# EAGLE design Model01 (EAGLE 7.4.0)
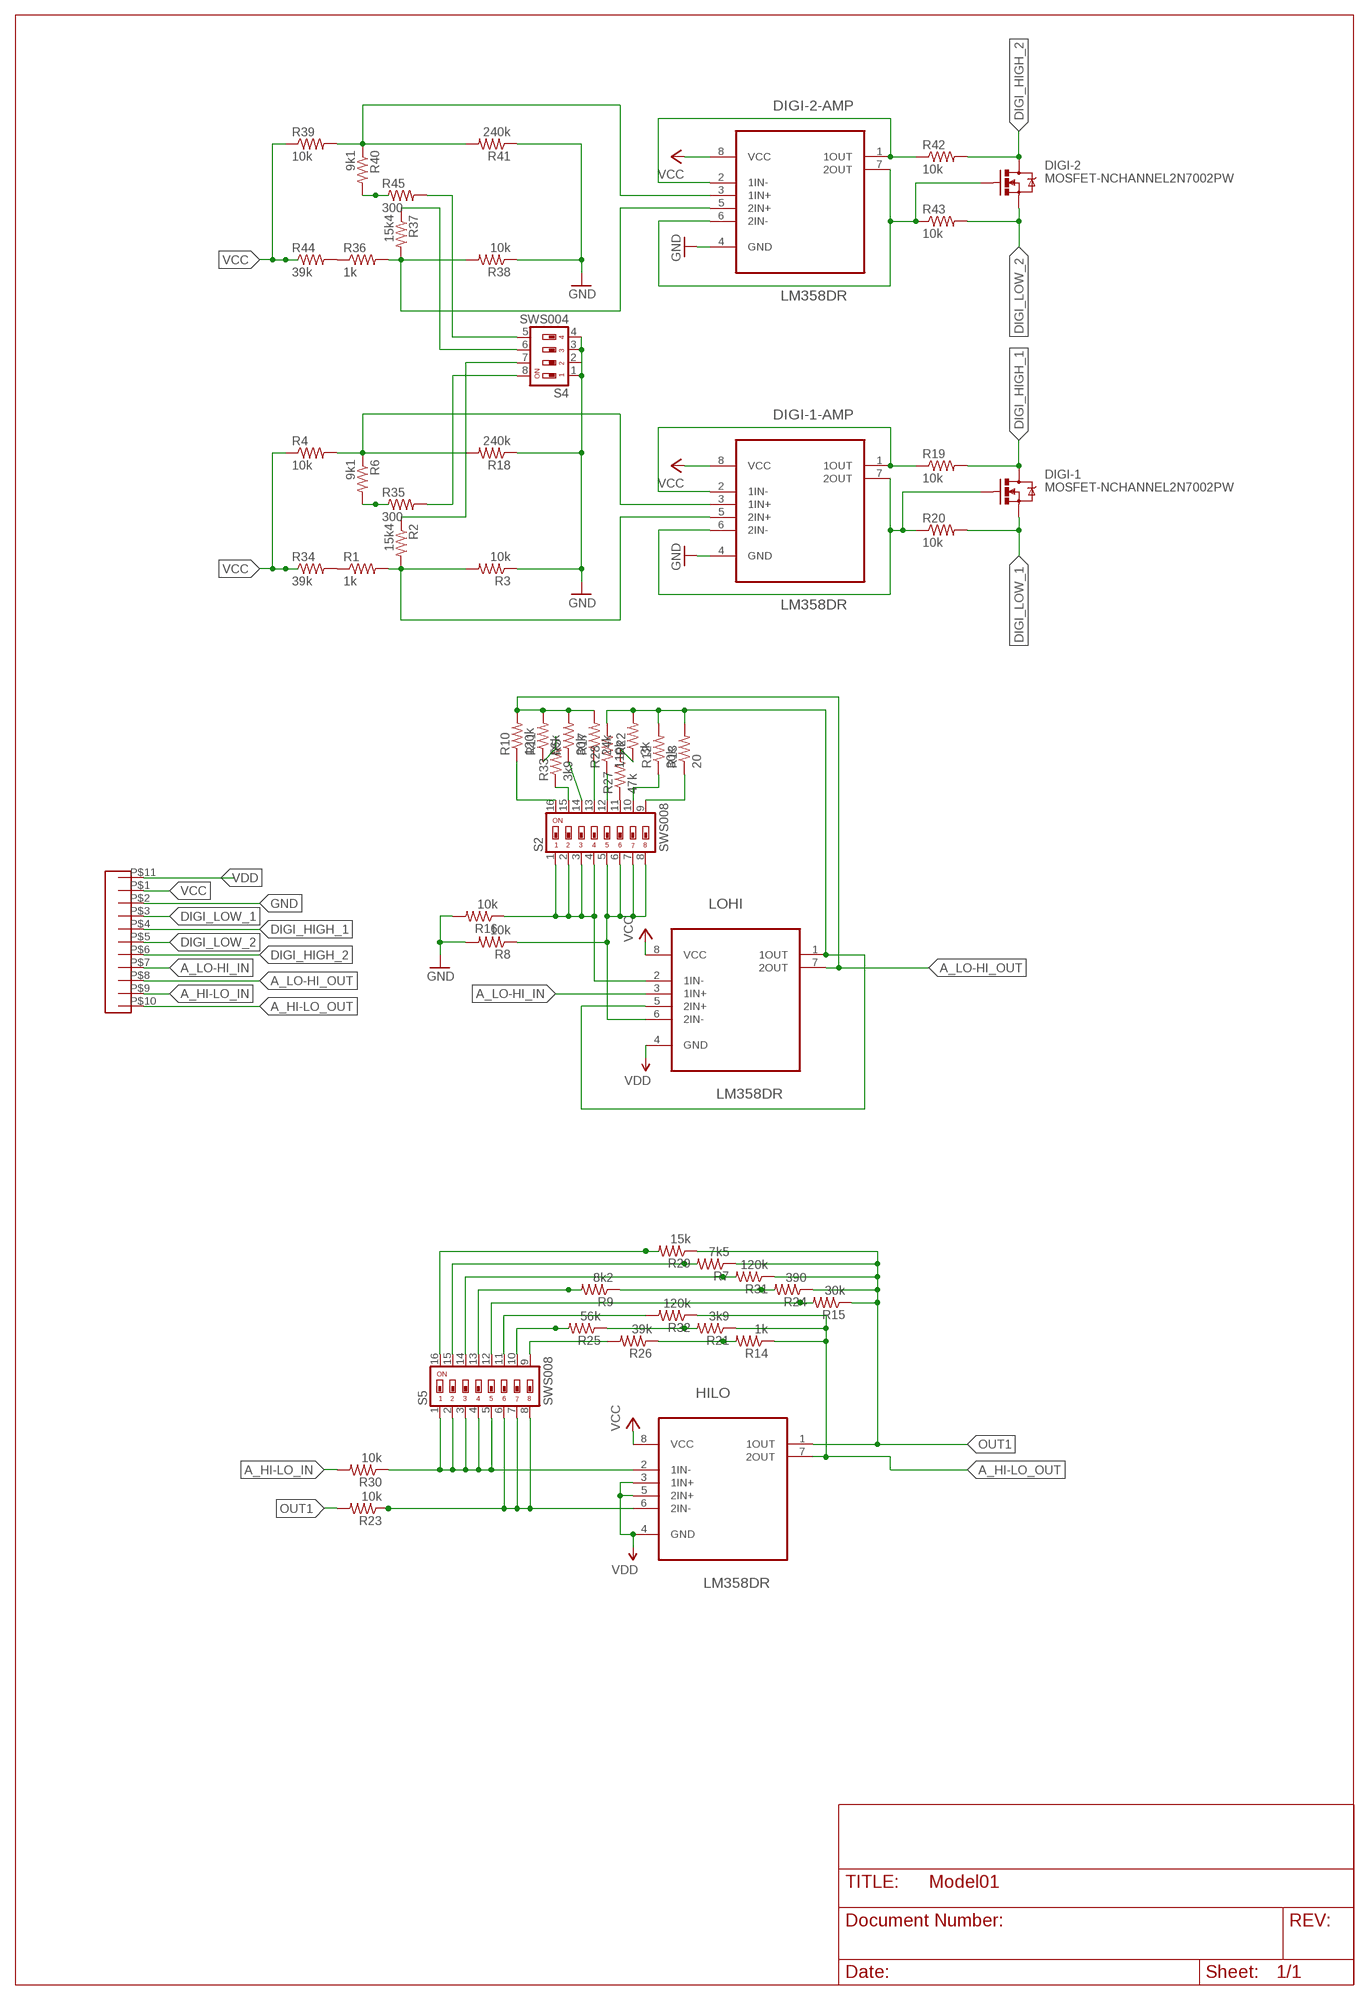
[diagram p0: schematic, sheet 1]

## Parts
DIGI-1  MOSFET-NCHANNEL2N7002PW  [SOT323]
DIGI-1-AMP  LM358DR  [SOIC127P600X175-8N]
DIGI-2  MOSFET-NCHANNEL2N7002PW  [SOT323]
DIGI-2-AMP  LM358DR  [SOIC127P600X175-8N]
HILO  LM358DR  [SOIC127P600X175-8N]
LOHI  LM358DR  [SOIC127P600X175-8N]
R1  1k  R-US_R0805  [R0805]
R2  15k4  R-US_R0805  [R0805]
R3  10k  R-US_R0805  [R0805]
R4  10k  R-US_R0805  [R0805]
R5  30k  R-US_R0805  [R0805]
R6  9k1  R-US_R0805  [R0805]
R7  7k5  R-US_R0805  [R0805]
R8  10k  R-US_R0805  [R0805]
R9  8k2  R-US_R0805  [R0805]
R10  120k  R-US_R0805  [R0805]
R11  56k  R-US_R0805  [R0805]
R12  30k  R-US_R0805  [R0805]
R13  20  R-US_R0805  [R0805]
R14  1k  R-US_R0805  [R0805]
R15  30k  R-US_R0805  [R0805]
R16  10k  R-US_R0805  [R0805]
R17  24k  R-US_R0805  [R0805]
R18  240k  R-US_R0805  [R0805]
R19  10k  R-US_R0805  [R0805]
R20  10k  R-US_R0805  [R0805]
R21  3k9  R-US_R0805  [R0805]
R22  3k  R-US_R0805  [R0805]
R23  10k  R-US_R0805  [R0805]
R24  390  R-US_R0805  [R0805]
R25  56k  R-US_R0805  [R0805]
R26  39k  R-US_R0805  [R0805]
R27  47k  R-US_R0805  [R0805]
R28  110k  R-US_R0805  [R0805]
R29  15k  R-US_R0805  [R0805]
R30  10k  R-US_R0805  [R0805]
R31  120k  R-US_R0805  [R0805]
R32  120k  R-US_R0805  [R0805]
R33  3k9  R-US_R0805  [R0805]
R34  39k  R-US_R0805  [R0805]
R35  300  R-US_R0805  [R0805]
R36  1k  R-US_R0805  [R0805]
R37  15k4  R-US_R0805  [R0805]
R38  10k  R-US_R0805  [R0805]
R39  10k  R-US_R0805  [R0805]
R40  9k1  R-US_R0805  [R0805]
R41  240k  R-US_R0805  [R0805]
R42  10k  R-US_R0805  [R0805]
R43  10k  R-US_R0805  [R0805]
R44  39k  R-US_R0805  [R0805]
R45  300  R-US_R0805  [R0805]
S2  SWS008  [SMS-008]
S4  SWS004  [SMS-004]
S5  SWS008  [SMS-008]
U$1  5.08PITCHTERMINAL  [10KPL508]

## Nets
A_HI-LO_IN: R30.2 U$1.P$9
A_HI-LO_OUT: HILO.7(2OUT) R14.1 R21.1 R32.1 U$1.P$10
A_LO-HI_IN: LOHI.3(1IN+) U$1.P$7
A_LO-HI_OUT: LOHI.7(2OUT) R5.2 R10.2 R11.2 R17.2 U$1.P$8
DI-1: DIGI-1-AMP.1(1OUT) DIGI-1-AMP.2(1IN-) R19.1
DIGI_HIGH_1: DIGI-1.3(D) R19.2 U$1.P$4
DIGI_HIGH_2: DIGI-2.3(D) R42.2 U$1.P$6
DIGI_LOW_1: DIGI-1.2(S) R20.2 U$1.P$3
DIGI_LOW_2: DIGI-2.2(S) R43.2 U$1.P$5
GND: DIGI-1-AMP.4(GND) DIGI-2-AMP.4(GND) R3.1 R8.2 R16.2 R18.1 R38.1 R41.1 S4.1 S4.2 S4.3 S4.4 U$1.P$2
N$2: DIGI-1-AMP.3(1IN+) R4.2 R6.1 R18.2
N$4: R2.1 S4.7
N$5: R6.2 R35.1
N$6: DIGI-1-AMP.5(2IN+) R1.2 R2.2 R3.2
N$8: DIGI-1-AMP.6(2IN-) DIGI-1-AMP.7(2OUT) DIGI-1.1(G) R20.1
N$9: DIGI-2-AMP.5(2IN+) R36.2 R37.2 R38.2
N$10: HILO.2(1IN-) R30.1 S5.1 S5.2 S5.3 S5.4 S5.5
N$11: DIGI-2-AMP.3(1IN+) R39.2 R40.1 R41.2
N$13: R10.1 S2.16
N$14: R33.1 S2.15
N$15: R1.1 R34.2
N$16: R5.1 S2.14
N$17: R17.1 S2.13
N$18: R28.1 S2.12
N$19: R27.1 S2.11
N$20: R12.1 S2.10
N$21: R13.1 S2.9
N$22: R29.2 S5.16
N$23: LOHI.1(1OUT) LOHI.5(2IN+) R12.2 R13.2 R22.2 R28.2
N$24: R7.2 S5.15
N$26: R31.2 S5.14
N$27: R9.2 S5.13
N$28: R15.2 S5.12
N$29: R32.2 S5.11
N$30: HILO.6(2IN-) R23.1 S5.6 S5.7 S5.8
N$31: R25.2 S5.10
N$32: R26.2 S5.9
N$34: R14.2 R26.1
N$36: R21.2 R25.1
N$37: R9.1 R24.2
N$38: R22.1 R27.2
N$41: R11.1 R33.2
N$42: R35.2 S4.8
N$46: LOHI.2(1IN-) R16.1 S2.1 S2.2 S2.3 S2.4
N$50: LOHI.6(2IN-) R8.1 S2.5 S2.6 S2.7 S2.8
N$63: DIGI-2-AMP.1(1OUT) DIGI-2-AMP.2(1IN-) R42.1
N$64: DIGI-2-AMP.6(2IN-) DIGI-2-AMP.7(2OUT) DIGI-2.1(G) R43.1
N$67: R37.1 S4.6
N$68: R36.1 R44.2
N$69: R40.2 R45.1
N$70: R45.2 S4.5
OUT1: HILO.1(1OUT) R7.1 R15.1 R23.2 R24.1 R29.1 R31.1
VCC: DIGI-1-AMP.8(VCC) DIGI-2-AMP.8(VCC) HILO.8(VCC) LOHI.8(VCC) R4.1 R34.1 R39.1 R44.1 U$1.P$1
VDD: HILO.3(1IN+) HILO.4(GND) HILO.5(2IN+) LOHI.4(GND) U$1.P$11

## Library data of the parts
DIGI-1 DIGI-2 = SparkFun-DiscreteSemi:MOSFET-NCHANNEL: Common NMOSFET Parts MFG P/N Store ID Prod ID FDD8780 TRANS-09984 SI7820DN TRANS-11055 FDS6630A IC-08089 2N7002PW TRANS-11151 FQP30N06L COM-10213 TRANS-10060 BSS123LT1G TRANS-08345 BSS138 TRANS-00830 BS170 2N7000; PROD_ID: TRANS-11151
DIGI-1-AMP DIGI-2-AMP HILO LOHI = Texas Instruments_By_element14_Batch_1:LM358DR: OPERATIONAL AMPLIFIERS; MPN: LM358DR; OC_FARNELL: 1831865; OC_NEWARK: 34K7599; PACKAGE: SOIC-8; SUPPLIER: Texas Instruments
R1-R45 = rcl:R-US_: RESISTOR, American symbol
S2 S5 = smd-special:SWS008: SMD Dip Switch 8 pol.
S4 = smd-special:SWS004: SMD Dip Switch 4 pol.
U$1 = ruuviliitin:5.08PITCHTERMINAL

## Board
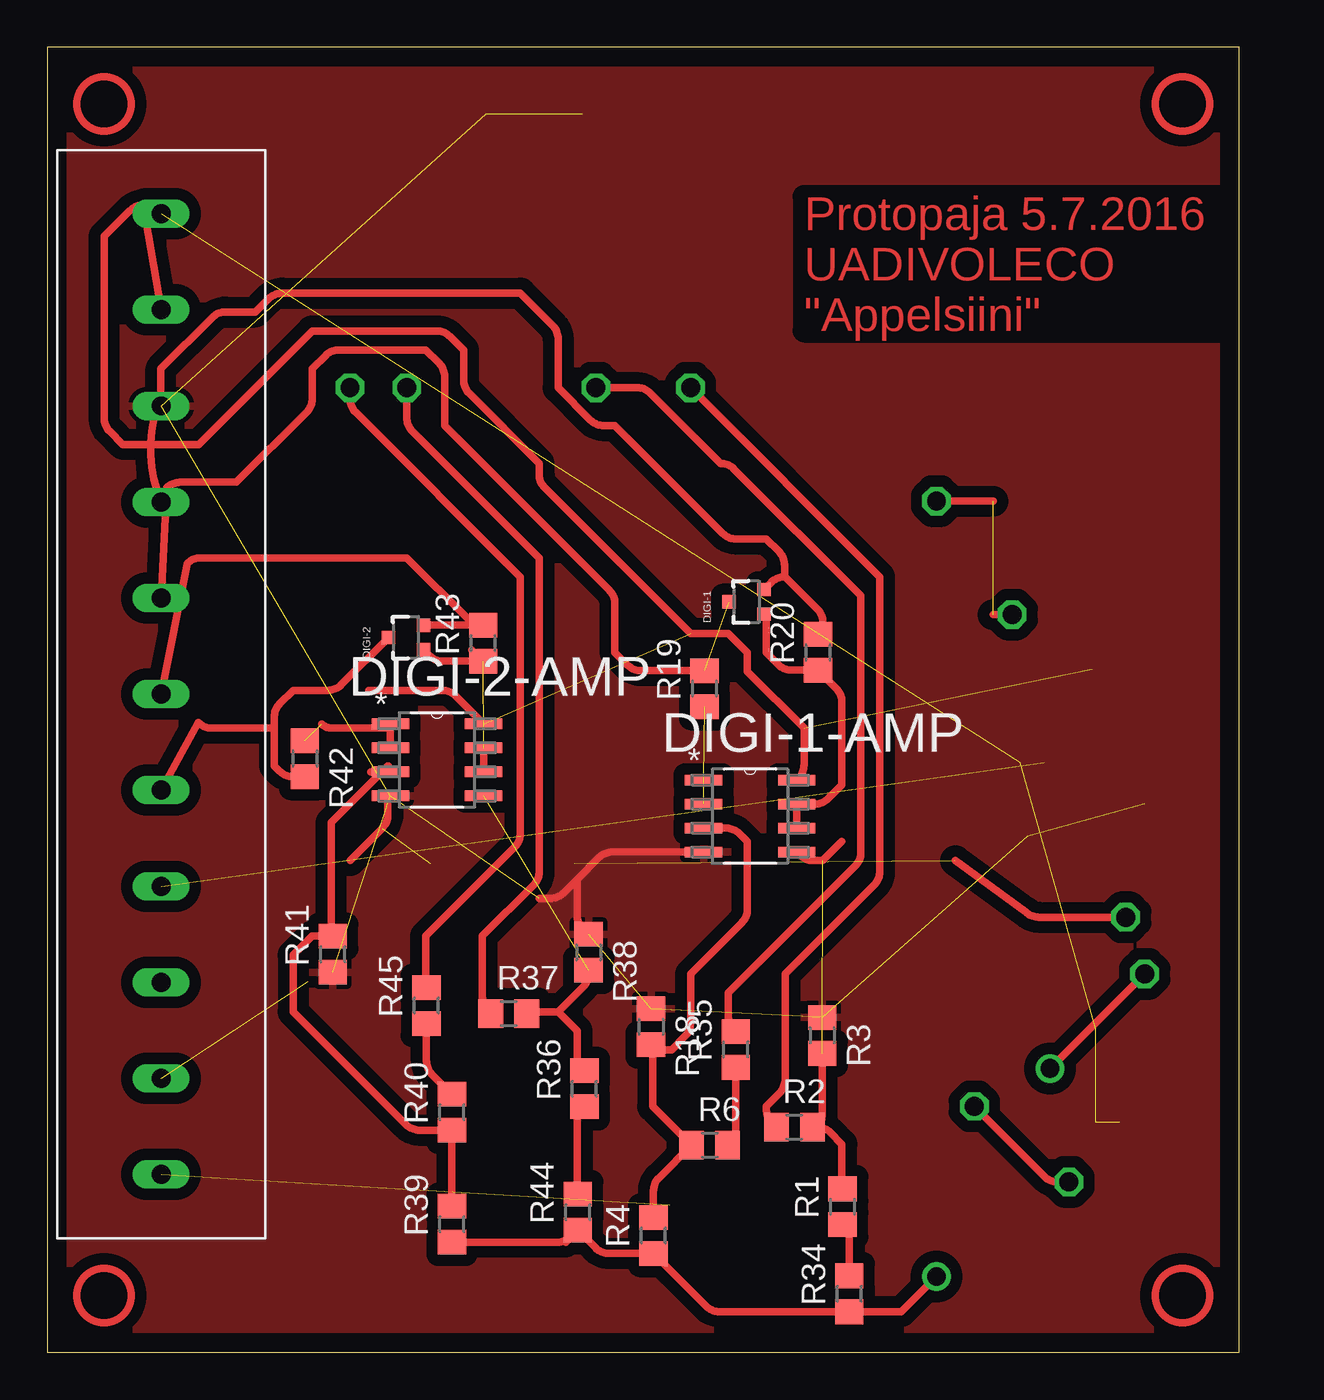
[diagram p1: board, top side]
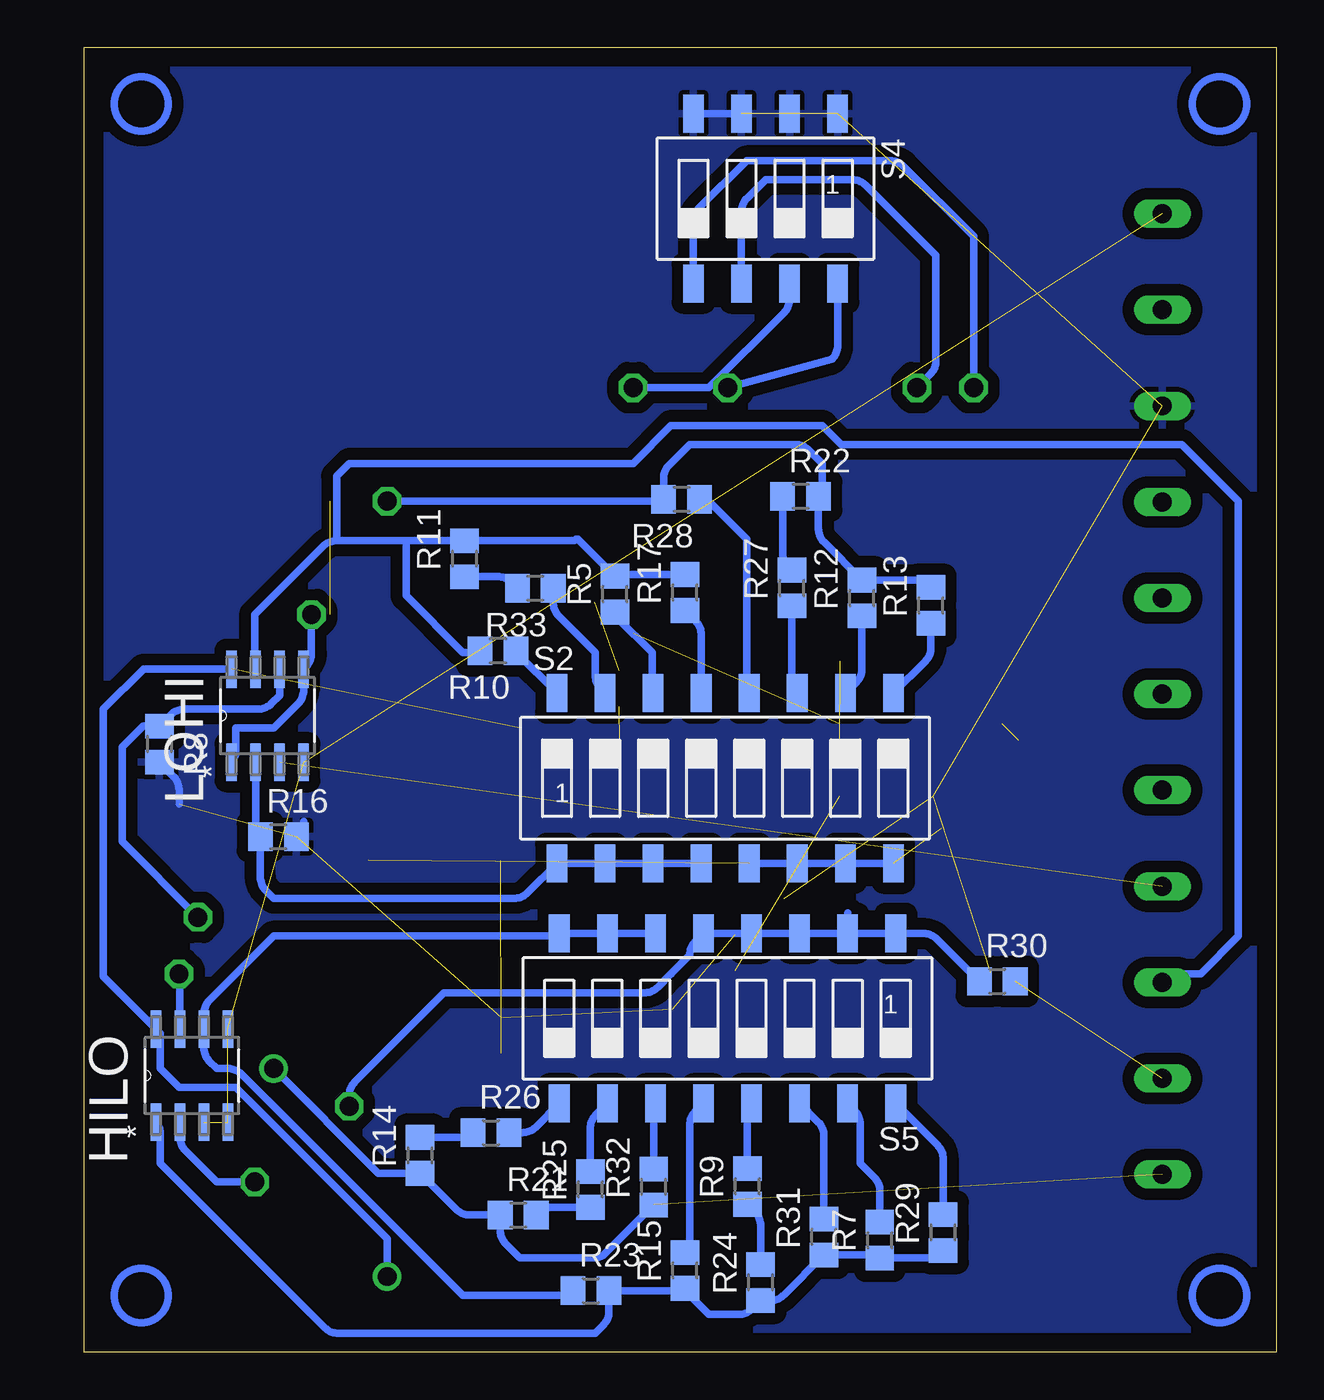
[diagram p2: board, bottom side, seen from below]

Size 63 x 69 mm. Coordinates in mm from the lower left corner, seen from the top.
Outline: 0,0 63,0 63,69 0,69 0,0
Copper layers (1*16): Top 0.035mm / dielectric 1.5mm / Bottom 0.035mm
Design rules "default": minimum track width 10mil, minimum drill 24mil, track to track 8mil, track to pad 8mil, pad to pad 8mil, via to via 8mil, smd to smd 8mil, copper to edge 40mil, drill to drill 8mil, minimum pad ring 10mil, minimum via ring 8mil, stop-mask expansion 4mil, vias tented up to drill 0mil, thermal gap 10mil

### Footprints (pad centres in the part's own frame; a part is rotated, then mirrored left to right if it is on the bottom)
SOT323 = smd 0.7 x 0.7: 1 -0.65,-0.925; 2 0.65,-0.925; 3 0,0.925
SOIC127P600X175-8N = smd 1.981 x 0.559: 1 -2.464,1.905; 2 -2.464,0.635; 3 -2.464,-0.635; 4 -2.464,-1.905; 5 2.464,-1.905; 6 2.464,-0.635; 7 2.464,0.635; 8 2.464,1.905
R0805 = smd 1.3 x 1.5: 1 -0.95,0; 2 0.95,0
SMS-008 = smd 1.092 x 2.007: 1 -8.89,-4.496; 2 -6.35,-4.496; 3 -3.81,-4.496; 4 -1.27,-4.496; 5 1.27,-4.496; 6 3.81,-4.496; 7 6.35,-4.496; 8 8.89,-4.496; 9 8.89,4.496; 10 6.35,4.496; 11 3.81,4.496; 12 1.27,4.496; 13 -1.27,4.496; 14 -3.81,4.496; 15 -6.35,4.496; 16 -8.89,4.496
SMS-004 = smd 1.092 x 2.007: 1 -3.81,-4.496; 2 -1.27,-4.496; 3 1.27,-4.496; 4 3.81,-4.496; 5 3.81,4.496; 6 1.27,4.496; 7 -1.27,4.496; 8 -3.81,4.496
10KPL508 = drill 1 long: P$1 -20.32,0; P$2 -15.24,0; P$3 -10.16,0; P$4 -5.08,0; P$5 0,0; P$6 5.08,0; P$7 10.16,0; P$8 15.24,0; P$9 20.32,0; P$10 25.4,0; P$11 -25.4,0

### Placement (x,y rotation side)
DIGI-1  36.96,39.68 90 top
DIGI-1-AMP  37.15,28.35 0 top
DIGI-2  18.96,37.79 90 top
DIGI-2-AMP  20.6,31.32 0 top
HILO  57.32,14.63 90 bottom
LOHI  53.32,33.66 90 bottom
R1  42.04,7.69 90 top
R2  39.49,11.91 0 top
R3  40.96,16.75 270 top
R4  32.04,6.17 90 top
R5  34.96,40.09 90 bottom
R6  35.01,10.96 0 top
R7  20.96,5.93 90 bottom
R8  59.04,32.15 270 bottom
R9  27.96,8.77 90 bottom
R10  41.14,37.09 180 bottom
R11  42.91,41.96 90 bottom
R12  21.91,39.88 90 bottom
R13  18.26,39.49 90 bottom
R14  45.26,10.41 90 bottom
R15  31.26,4.33 90 bottom
R16  52.75,27.26 0 bottom
R17  31.26,40.17 90 bottom
R18  31.91,17.21 270 top
R19  34.74,35.09 90 top
R20  40.74,37.01 90 top
R21  40.07,7.26 0 bottom
R22  25.15,45.26 0 bottom
R23  36.23,3.26 0 bottom
R24  27.26,3.69 90 bottom
R25  36.26,8.61 90 bottom
R26  41.51,11.61 0 bottom
R27  25.61,40.41 90 bottom
R28  31.44,45.09 180 bottom
R29  17.61,6.33 90 bottom
R30  14.75,19.61 0 bottom
R31  23.91,6.09 90 bottom
R32  32.91,8.74 90 bottom
R33  39.17,40.39 180 bottom
R34  42.39,3.09 90 top
R35  36.39,16.01 90 top
R36  28.39,13.93 90 top
R37  24.39,17.91 0 top
R38  28.61,21.15 270 top
R39  21.39,6.77 90 top
R40  21.39,12.69 90 top
R41  15.09,21.04 90 top
R42  13.61,31.39 270 top
R43  23.04,37.49 90 top
R44  28.04,7.41 90 top
R45  20.04,18.33 90 top
S2  29.13,30.35 0 bottom
S4  27,61 180 bottom
S5  29.01,17.65 180 bottom
U$1  6.02,34.8 270 top

### Tracks (layer width: path | path; a pad name or v marks a point on that pad's centre or on a via)
A_HI-LO_IN  (1 unrouted)
A_HI-LO_OUT  (via drill 1 pad 1.42)  (1 unrouted)
  Top 0.406: v53,15 v58,20
  Bottom 0.406: R32.1 35.49,5.21 arc45 36,5 40,5 40.73,5.73 arc45 41.02,6.43 R21.1 42.65,7.26 arc45 43.35,7.55 R14.1 47.46,9.46 v53,15 | v58,20 arc45 57.95,19.89 HILO.7
A_LO-HI_IN  (1 unrouted)
A_LO-HI_OUT
  Bottom 0.406: LOHI.7 arc45 54,36.23 54,39 50.38,42.62 arc45 49.68,42.91 | 49.68,42.91 46,42.91 | 46,42.91 R11.2 37.22,42.91 arc-45 37,43 arc45 36.86,42.94 R5.2 arc45 34.77,41.12 R17.2 | R10.2 arc45 42.31,37 43,37 46,40 46,42.91 | U$1.P$8 5.58,20 4,20 2,22 2,45 5,48 23,48 24,49 32,49 34,47 49,47 49.68,46.32 49.68,42.91
DI-1  (2 unrouted)
DIGI_HIGH_1  (1 unrouted)
  Top 0.406: U$1.P$4 6.31,45.71 arc-45 7.01,46 10,46 13.71,49.71 arc45 14,50.41 14,52 14.71,52.71 arc-45 15.41,53 20,53 20.71,52.29 arc-45 21,51.59 21,49 29.71,40.29 arc-45 30,39.59 30,37 30.67,36.33 arc45 31.37,36.04 R19.2
DIGI_HIGH_2
  Top 0.406: DIGI-2.3 15.54,35.29 arc-45 14.83,35 13,35 12.29,34.29 arc45 12,33.59 12,33 | 12,33 12,31 12.27,30.73 arc45 12.97,30.44 R42.2 | 12,33 8.69,33 arc-45 7.99,33.29 U$1.P$6
DIGI_LOW_1
  Top 0.406: DIGI-1.2 38.26,40.71 arc-45 38.97,41 | 38.97,41 39,41 40.71,39.29 arc-45 41,38.59 41,38 arc-45 40.9,37.96 R20.2 | 38.97,41 38.97,41.62 arc45 38.68,42.32 38,43 36.41,43 arc-45 35.71,43.29 30,49 29.41,49 arc-45 28.71,49.29 27,51 27,53.59 arc45 26.71,54.29 25,56 12.41,56 arc45 11.71,55.71 11,55 9.41,55 arc45 8.71,54.71 6,52 6,50.55 arc45 U$1.P$3
DIGI_LOW_2
  Top 0.406: DIGI-2.2 R43.2 22.97,38.44 arc-45 22.27,38.73 19,42 8.09,42 arc45 7.39,41.71 U$1.P$5
GND  (10 unrouted)
  Top 0.406: R38.1 28.29,22.42 arc-45 28,23.12 28,25 | 28,25 29.15,26.15 arc-45 29.86,26.45 DIGI-1-AMP.4 | 28,25 27.29,24.29 arc-45 26.59,24 26,24
  Bottom 0.406: R16.2 51.71,27.35 arc-45 51.41,28.06 | S4.4 S4.3 | R8.2 58.29,30.45 arc45 58,29.75 58,29
  pour Top (isolate 0.61): 0,69 0,0 63,0 63,69
  pour Bottom (isolate 0.61): 0,69 0,0 63,0 63,69
N$2
  Top 0.406: R4.2 32.04,8.53 arc-45 32.33,9.23 R6.1 arc-45 34.03,10.97 32,13 32,16.04 arc45 R18.2 arc45 32.54,16 33,16 33.71,16.71 arc45 34,17.41 34,20 36.71,22.71 arc45 37,23.41 37,27 36.58,27.42 arc45 35.87,27.71 DIGI-1-AMP.3
N$4  (via drill 1 pad 1.42)
  Top 0.406: R2.1 38.29,12.16 arc-45 38,12.86 38,13 38.71,13.71 arc45 39,14.41 39,20 43.71,24.71 arc45 44,25.41 44,41 v34,51
  Bottom 0.406: v34,51 30,51 26.02,54.98 arc-45 25.73,55.68 S4.7
N$5
  Top 0.406: R6.2 36.1,11.1 arc45 36.39,11.8 R35.1
N$6  (1 unrouted)
  Top 0.406: R1.2 arc-45 42,8.74 42,11 41.38,11.62 arc45 40.68,11.91 | 40.68,11.91 R2.2 | 40.68,11.91 arc45 40.96,12.6 R3.2 | DIGI-1-AMP.5 39.77,26.29 arc45 40.47,26 41,26 42,27
N$8
  Top 0.406: DIGI-1.1 arc-45 38,38.75 38,37 38.65,36.35 arc45 39.35,36.06 R20.1 41.71,35.09 arc-45 42,34.39 42,30 41.28,29.28 arc-45 40.57,28.98 DIGI-1-AMP.7 DIGI-1-AMP.6
N$9  (1 unrouted)
  Top 0.406: R37.2 arc-45 25.56,18 27,18 | 27,18 28.32,19.32 arc45 28.61,20.02 R38.2 | R36.2 28.29,14.98 arc-45 28,15.68 28,17 27,18
N$10  (via drill 1 pad 1.42)
  Top 0.406: v49,13 52.71,9.29 arc45 53.41,9 v54,9
  Bottom 0.406: S5.2 S5.1 18.65,22.15 arc45 17.94,21.85 R30.1 | S5.2 S5.3 S5.4 S5.5 30.71,21.72 arc-45 31,21.01 31.99,20.02 arc-45 32,20 32.71,19.29 arc45 33.41,19 44,19 48.71,14.29 arc-45 49,13.59 v49,13 | 22.66,23.24 S5.2 | v54,9 56,9 57.66,10.66 arc45 57.95,11.37 HILO.2
N$11
  Top 0.406: 21.71,8.04 R39.2 R40.1 | 15.07,22 arc-45 R41.2 arc45 15.07,22 | 15.07,22 14,22 13,21 13,18 18.97,12.03 arc45 19.67,11.74 R40.1 | R40.1 21.22,11.91 arc45 21,12 | 15.07,22 arc-45 15,22.16 15,28 18,31 18.01,30.99 arc-45 DIGI-2-AMP.3 17.1,30.69
N$13
  Bottom 0.406: S2.16 40.14,36.96 arc45 R10.1
N$14
  Bottom 0.406: S2.15 35.71,35.07 arc45 36,35.78 36,37 37.93,38.93 arc45 38.22,39.63 R33.1
N$15
  Top 0.406: R1.1 42.1,6.68 arc-45 42.39,5.98 R34.2
N$16
  Bottom 0.406: S2.14 arc45 33,34.99 33,37 34.83,38.83 arc45 R5.1
N$17
  Bottom 0.406: R17.1 30.69,38.65 arc45 30.4,37.95 S2.13
N$18
  Bottom 0.406: S2.12 arc45 28,35.18 28,43 29.81,44.81 arc-45 R28.1
N$19
  Bottom 0.406: S2.11 arc45 25.61,35.55 R27.1
N$20
  Bottom 0.406: S2.10 22.2,35.42 arc-45 21.91,36.13 R12.1
N$21
  Bottom 0.406: S2.9 18.55,36.53 arc-45 18.26,37.24 R13.1
N$22
  Bottom 0.406: S5.16 17.9,10.94 arc45 17.61,10.23 R29.2
N$23  (via drill 1 pad 1.42)  (1 unrouted)
  Top 0.406: v47,45 50,45 | v51,39 50,39
  Bottom 0.406: R13.2 18.36,40.54 arc-45 19.06,40.83 R12.2 23.91,42.83 arc45 24.2,43.53 R22.2 arc-45 24,45.74 24,47 24.71,47.71 arc-45 25.41,48 31,48 32.1,46.9 arc-45 32.39,46.2 R28.2 arc45 32.61,45 v47,45 | v51,39 51,36.95 arc45 51.29,36.25 LOHI.5 51.41,35 arc45 51.71,34.29 53,33 55,33 55,31.74 arc45 LOHI.1
N$24
  Bottom 0.406: S5.15 22.29,12.79 arc45 22,12.08 22,10 21.25,9.25 arc45 20.96,8.55 R7.2
N$26
  Bottom 0.406: S5.14 24.2,12.16 arc45 23.91,11.45 R31.2
N$27
  Bottom 0.406: S5.13 arc-45 27.96,12.62 R9.2
N$28
  Bottom 0.406: S5.12 30.71,12.73 arc-45 31,12.02 31,5 31.25,5.25 arc45 R15.2
N$29
  Bottom 0.406: S5.11 arc-45 32.91,12.94 R32.2
N$30
  Bottom 0.406: S5.6 S5.7 S5.8 arc45 38.25,22 53,22 56.39,18.61 arc-45 56.69,17.9 HILO.6 56.69,16.1 arc-45 56.39,15.39 56,15 55.41,15 arc45 54.71,14.71 43,3 37.81,3 arc-45 R23.1
N$31
  Bottom 0.406: S5.10 35.97,12.55 arc-45 36.26,11.84 R25.2
N$32
  Bottom 0.406: S5.9 39.15,11.9 arc45 39.86,11.61 R26.2
N$34
  Bottom 0.406: R26.1 arc-45 42.53,11.64 arc45 43.21,11.36 R14.2
N$36
  Bottom 0.406: R21.2 39.01,7.37 arc45 38.31,7.66 R25.1
N$37
  Bottom 0.406: R9.1 27.55,7.41 arc45 27.26,6.71 R24.2
N$38
  Bottom 0.406: R27.2 25.81,41.56 arc45 26.1,42.26 R22.1
N$41
  Bottom 0.406: R33.2 40.45,40.72 arc-45 41.15,41.01 R11.1
N$42  (via drill 1 pad 1.42)
  Top 0.406: R35.2 36.29,17.06 arc-45 36,17.76 36,19 42.71,25.71 arc45 43,26.41 43,40 36.29,46.71 arc45 35.59,47 31.88,50.71 arc45 31.17,51 v29,51
  Bottom 0.406: v29,51 23.48,52.52 arc-45 23.19,53.22 S4.8
N$46
  Bottom 0.406: S2.4 S2.3 S2.2 S2.1 39.58,24.29 arc45 40.29,24 53,24 53.41,24.41 arc45 53.7,25.11 R16.1 arc45 53.95,27.88 LOHI.2
N$50  (via drill 1 pad 1.42)  (2 unrouted)
  Top 0.406: 48,26 51.71,23.29 arc45 52.41,23 v57,23 | 16,26 17.71,27.71 arc45 18,28.41 18,29
  Bottom 0.406: S2.8 S2.7 S2.6 S2.5 | LOHI.6 52.69,34.73 53.12,34.29 arc45 53.83,34 57.73,34 arc-45 58.43,33.71 R8.1 59.9,33.1 61,32 61,27 v57,23
N$63  (1 unrouted)
  Top 0.406: 14.49,33.23 arc45 15.04,33 18,33 18.07,33.07 arc45 DIGI-2-AMP.1 DIGI-2-AMP.2
N$64  (1 unrouted)
  Top 0.406: 22.44,37.14 R43.1 20.9,36.54 arc-45 20.19,36.83 DIGI-2.1 | DIGI-2-AMP.6 DIGI-2-AMP.7
N$67  (via drill 1 pad 1.42)
  Top 0.406: R37.1 23.29,18.06 arc-45 23,18.76 23,22 25.71,24.71 arc45 26,25.41 26,42 19.29,48.71 arc-45 19,49.41 v19,51
  Bottom 0.406: v19,51 18.29,51.71 arc-45 18,52.41 18,58 21.71,61.71 arc-45 22.41,62 27,62 27.98,61.02 arc-45 28.27,60.32 S4.6
N$68
  Top 0.406: 28.39,8.71 R44.2 28.04,8.9 arc45 28,9 28,12.18 arc-45 28.29,12.88 R36.1
N$69
  Top 0.406: R40.2 20.33,14.7 arc-45 20.04,15.4 R45.1
N$70  (via drill 1 pad 1.42)
  Top 0.406: R45.2 arc-45 20,19.38 20,22 24.71,26.71 arc45 25,27.41 25,41 16.29,49.71 arc-45 16,50.41 v16,51
  Bottom 0.406: v16,51 16,59 19.71,62.71 arc-45 20.41,63 28,63 30.52,60.48 arc-45 30.81,59.78 S4.5
OUT1
  Bottom 0.406: R29.1 17.72,5.27 arc45 18.42,4.98 R7.1 arc-45 21.35,5.14 R31.1 26.02,3.03 arc45 26.72,2.74 R24.1 27.71,2.29 arc45 28.41,2 30,2 31.18,3.17 arc45 R15.1 arc45 31.55,3.26 R23.2 35.28,2.13 arc45 35.57,1.43 36,1 49.59,1 arc45 50.29,1.29 59,10 59,11.62 arc-45 HILO.1
VCC  (via drill 1 pad 1.42)  (2 unrouted)
  Top 0.406: R44.1 27.4,5.82 | R44.1 27.69,6.11 arc-45 26.99,5.82 R39.1 | R44.1 28.99,5.51 arc45 29.69,5.22 R4.1 34.83,2.43 arc45 35.53,2.14 R34.1 45.14,2.14 v47,4 | DIGI-2-AMP.8 21.58,34.71 arc45 20.88,35 17,35 | DIGI-1-AMP.8 39.71,30.35 arc45 40,31.05 40,33 37,36 37,37 36,38 34,38 26.29,45.71 arc-45 26,46.41 26,47 22.29,50.71 arc-45 22,51.41 22,53 21.29,53.71 arc45 20.59,54 14,54 8,48 4,48 3.29,48.71 arc-45 3,49.41 3,59 4.37,60.37 arc-45 5.07,60.66 U$1.P$1
  Bottom 0.406: LOHI.8 59.88,36.12 62,34 62,19.87 HILO.8 59,16.87 59,15 58,14 55,14 47,6 v47,4
VDD  (4 unrouted)
(copper drawn outside any net)
  shapes: Bottom circle x4, Top circle x4

### Text on the board
Top: Protopaja 5.7.2016 / UADIVOLECO / "Appelsiini"